# Altium schematic sheet home.SchDoc
size A4
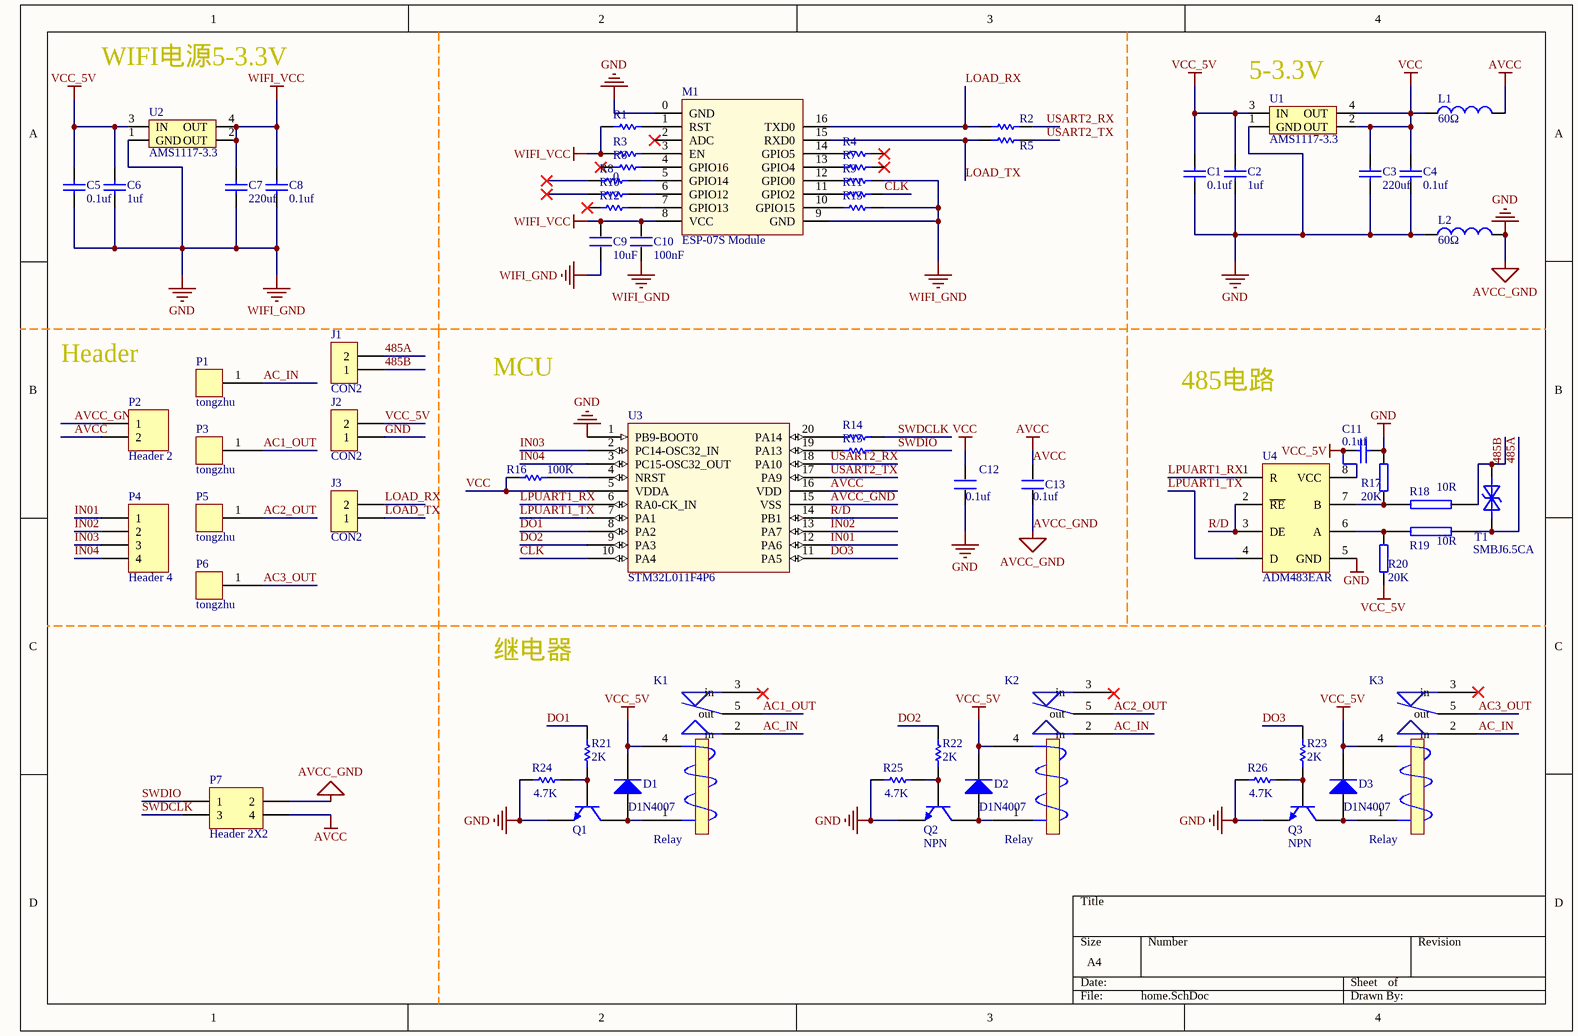
[diagram p0: home.SchDoc]

## Parts
C1  0.1uf  [0603p]
C2  1uf  [0603p]
C3  220uf  [0603p]
C4  0.1uf  [0603p]
C5  0.1uf  [0603p]
C6  1uf  [0603p]
C7  220uf  [0603p]
C8  0.1uf  [0603p]
C9  10uf  [0603p]
C10  100nf  [0603p]
C11  0.1uf  [0603p]
C12  0.1uf  [0603p]
C13  0.1uf  [0603p]
D1  D1N4007  [LC-SMA(DO-214AC)_S1]
D2  D1N4007  [LC-SMA(DO-214AC)_S1]
D3  D1N4007  [LC-SMA(DO-214AC)_S1]
J1  CON2  [HDR1X2]
J2  CON2  [HDR1X2]
J3  CON2  [HDR1X2]
K1  Relay  [JQC-3FF]
K2  Relay  [JQC-3FF]
K3  Relay  [JQC-3FF]
L1  value 60Ω  [0603p]  (hidden comment: Inductor)
L2  value 60Ω  [0603p]  (hidden comment: Inductor)
M1  ESP-07S Module  [ESP-07S Module]
P1  tongzhu  [tongzhu]
P2  Header 2  [HDR1X2]
P3  tongzhu  [tongzhu]
P4  Header 4  [HDR1X4]
P5  tongzhu  [tongzhu]
P6  tongzhu  [tongzhu]
P7  Header 2X2  [HDR2X2]
Q1  NPN  [SOT-23R]  (value not drawn)
Q2  NPN  [SOT-23R]
Q3  NPN  [SOT-23R]
R1  100K  [0603p]  (value not drawn)
R2  0  [0603p]  (value not drawn)
R3  100K  [0603p]  (value not drawn)
R4  0  [0603p]  (value not drawn)
R5  0  [0603p]  (value not drawn)
R6  0  [0603p]
R7  0  [0603p]  (value not drawn)
R8  0  [0603p]  (value not drawn)
R9  100K  [0603p]  (value not drawn)
R10  0  [0603p]  (value not drawn)
R11  0  [0603p]  (value not drawn)
R12  0  [0603p]  (value not drawn)
R13  100K  [0603p]  (value not drawn)
R14  0  [0603p]  (value not drawn)
R15  0  [0603p]  (value not drawn)
R16  100K  [0603p]
R17  20K  [0603p]
R18  10R  [0603p]
R19  10R  [0603p]
R20  20K  [0603p]
R21  2K  [0603p]
R22  2K  [0603p]
R23  2K  [0603p]
R24  4.7K  [0603p]
R25  4.7K  [0603p]
R26  4.7K  [0603p]
T1  SMBJ6.5CA  [LC-SMB(DO-214AA)_S1]
U1  AMS1117-3.3  [AMS1117]
U2  AMS1117-3.3  [AMS1117]
U3  STM32L011F4P6  [LC-TSSOP-20]
U4  ADM483EAR  [LC-SOIC-8_150mil]

## Nets
AVCC: C13.2 L1.2 P2.2 P7.4 U3.16(VDD)
AVCC_GND: C1.1 C2.1 C3.1 C4.1 C5.1 C6.1 C7.1 C8.1 C9.1 C10.1 C11.1 C12.1 C13.1 J2.1 L2.1 L2.2 M1.0(GND) M1.9(GND) P2.1 P7.2 Q1.3(E) Q2.3(E) Q3.3(E) R9.1 R13.1 R17.2 R24.1 R25.1 R26.1 U1.1(GND) U2.1(GND) U3.1(PB9-BOOT0) U3.15(VSS) U4.5(GND)  [also labelled GND, WIFI_GND]
VCC: C3.2 C4.2 C12.2 L1.1 R16.1 U1.2(OUT) U1.4(OUT) U3.5(VDDA)
VCC_5V: C1.2 C2.2 C5.2 C6.2 C11.2 D1.2(K) D2.2(K) D3.2(K) J2.2 K1.4 K2.4 K3.4 R20.1 U1.3(IN) U2.3(IN) U4.8(VCC)
WIFI_VCC: C7.2 C8.2 C9.2 C10.2 M1.8(VCC) R1.2 R3.2 U2.2(OUT) U2.4(OUT)
485A: J1.2 R19.1 T1.1
485B: J1.1 R18.1 T1.2
AC1_OUT: K1.5(out) P3.1
AC2_OUT: K2.5(out) P5.1
AC3_OUT: K3.5(out) P6.1
AC_IN: K1.2(in) K2.2(in) K3.2(in) P1.1
CLK: R11.1 U3.10(PA4)
DO1: R21.1 U3.8(PA2)
DO2: R22.1 U3.9(PA3)
DO3: R23.1 U3.11(PA5)
IN01: P4.1 U3.12(PA6)
IN02: P4.2 U3.13(PA7)
IN03: P4.3 U3.2(PC14-OSC32_IN)
IN04: P4.4 U3.3(PC15-OSC32_OUT)
LOAD_RX: J3.2 M1.16(TXD0) R2.1
LOAD_TX: J3.1 M1.15(RXD0) R5.1
LPUART1_RX: U3.6(RA0-CK_IN) U4.1(R)
LPUART1_TX: U3.7(PA1) U4.4(D)
R/D: U3.14(PB1) U4.2(~{RE}) U4.3(DE)
SWDCLK: P7.3 R14.2
SWDIO: P7.1 R15.2
USART2_RX: R2.2 U3.18(PA10)
USART2_TX: R5.2 U3.17(PA9)
NetD1_1: D1.1(A) K1.1 Q1.1(C)
NetD2_1: D2.1(A) K2.1 Q2.1(C)
NetD3_1: D3.1(A) K3.1 Q3.1(C)
NetM1_1: M1.1(RST) R1.1
NetM1_3: M1.3(EN) R3.1
NetM1_4: M1.4(GPIO16) R6.1
NetM1_5: M1.5(GPIO14) R8.1
NetM1_6: M1.6(GPIO12) R10.1
NetM1_7: M1.7(GPIO13) R12.1
NetM1_10: M1.10(GPIO15) R13.2
NetM1_11: M1.11(GPIO2) R11.2
NetM1_12: M1.12(GPIO0) R9.2
NetM1_13: M1.13(GPIO4) R7.2
NetM1_14: M1.14(GPIO5) R4.2
NetQ1_2: Q1.2(B) R21.2 R24.2
NetQ2_2: Q2.2(B) R22.2 R25.2
NetQ3_2: Q3.2(B) R23.2 R26.2
NetR14_1: R14.1 U3.20(PA14)
NetR15_1: R15.1 U3.19(PA13)
NetR16_2: R16.2 U3.4(NRST)
NetR17_1: R17.1 R18.2 U4.7(B)
NetR19_2: R19.2 R20.2 U4.6(A)

Not connected (* = marked no-connect by the designer): K1 3(in); K2 3(in); K3 3(in)*; M1 2(ADC)*; R4 1*; R6 2*; R7 1*; R8 2*; R10 2*; R12 2*

## Notes on the sheet
- WIFI电源5-3.3V
- (near U1) 5-3.3V
- Header
- MCU
- 485电路
- 继电器

## Library data of the parts
C1-C8 = Cap: Capacitor; Published: 8-Jun-2000; LatestRevisionDate: 17-Jul-2002; LatestRevisionNote: Re-released for DXP Platform.; PackageReference: RAD-0.3; Publisher: Altium Limited; PackageDescription: Radial Cap, Thru-Hole; 2 Leads; 0.3 in Pin Spacing
C9 C10 C12 C13 = C
  C9: value: 10uF
  C10: value: 100nF
  C12 C13: value: 0.1uF
C11 = CAP: Part Field 1: 多层片式陶瓷电容  Y5V 50V 0.1μF±20%   CL21F104MBNE; Part Field 2: 三星公司/风华公司; Part Field 3: 0.008; value: 0.1uf
D1-D3 = Diode 1N4007: 1 Amp General Purpose Rectifier; Published: 8-Jun-2000; LatestRevisionDate: 17-Jul-2002; LatestRevisionNote: Re-released for DXP Platform.; DatasheetVersion: 1998; PackageVersion: Aug-1999; PackageReference: DO-41; Publisher: Altium Limited; PackageDescription: Diode, Axial; Body 5.2 x 2.7 mm (LxDia. max), Lead Dia. 0.86 mm (max); Code_JEDEC: DO-204-AL; ComponentLink1Description: Manufacturer Link; ComponentLink1URL: http://www.fairchildsemi.com/; ComponentLink2Description: Datasheet; ComponentLink2URL: http://www.fairchildsemi.com/ds/1N%2F1N4001.pdf
J1-J3 = CON2: Connector
K1-K3 = JQC-3FF: 继电器05-1ZS(551)
L1 L2 = Inductor: Code_IEC: 1005; Published: 8-Jun-2000; LatestRevisionDate: 29-May-2009; LatestRevisionNote: IPC-7351 Footprint Added.; PackageReference: 0402-A; Publisher: Altium Limited; PackageDescription: Chip Inductor; Code_JEITA: 0402
P1 P3 P5 P6 = tongzhu: 铜柱
P2 = Header 2: Header, 2-Pin; LatestRevisionDate: 17-Jul-2002; LatestRevisionNote: Re-released for DXP Platform.; Publisher: Altium Limited
P4 = Header 4: Header, 4-Pin; LatestRevisionDate: 17-Jul-2002; LatestRevisionNote: Re-released for DXP Platform.; Publisher: Altium Limited
P7 = Header 2X2: Header, 2-Pin, Dual row; LatestRevisionDate: 17-Jul-2002; LatestRevisionNote: Re-released for DXP Platform.; Publisher: Altium Limited
Q1-Q3 = NPN: 8050; Published: 8-Jun-2000; LatestRevisionDate: 17-Jul-2002; LatestRevisionNote: Re-released for DXP Platform.; PackageReference: TO-226-AA; Publisher: Altium Limited; PackageDescription: TO, Flat Index; 3 In-Line, Axial Leads; Body Dia. 4.8mm; Leads 0.55 x 0.51 mm (max); Code_JEDEC: TO-226-AA
R1-R16 R21-R26 = Res1: Resistor; Published: 8-Jun-2000; LatestRevisionDate: 17-Jul-2002; LatestRevisionNote: Re-released for DXP Platform.; PackageReference: AXIAL-0.3; Publisher: Altium Limited; PackageDescription: Axial Device, Thru-Hole; 2 Leads; 0.3 in Pin Spacing
  R1 R3 R9 R13: Value: 100K
  R2 R4-R8 R10-R12 R14 R15: Value: 0
  R21-R23: Value: 2K
  R24-R26: Value: 4.7K
R17 R20 = RES: Part Field 1: 0603片式电阻   1KΩ±5%; Part Field 2: 三星公司/风华公司; Part Field 3: 0.004
R18 R19 = RES2
T1 = TVS: 快速瞬变二极管
U1 U2 = AMS1117
U4 = SN75LBC184: Part Field 1: 485芯片; Part Field 2: 文晔集团; Part Field 3: 1.5; Part Field 4: 13810449530; Part Field 5: 孟冬